# EAGLE design waltron (EAGLE 8.2.2)
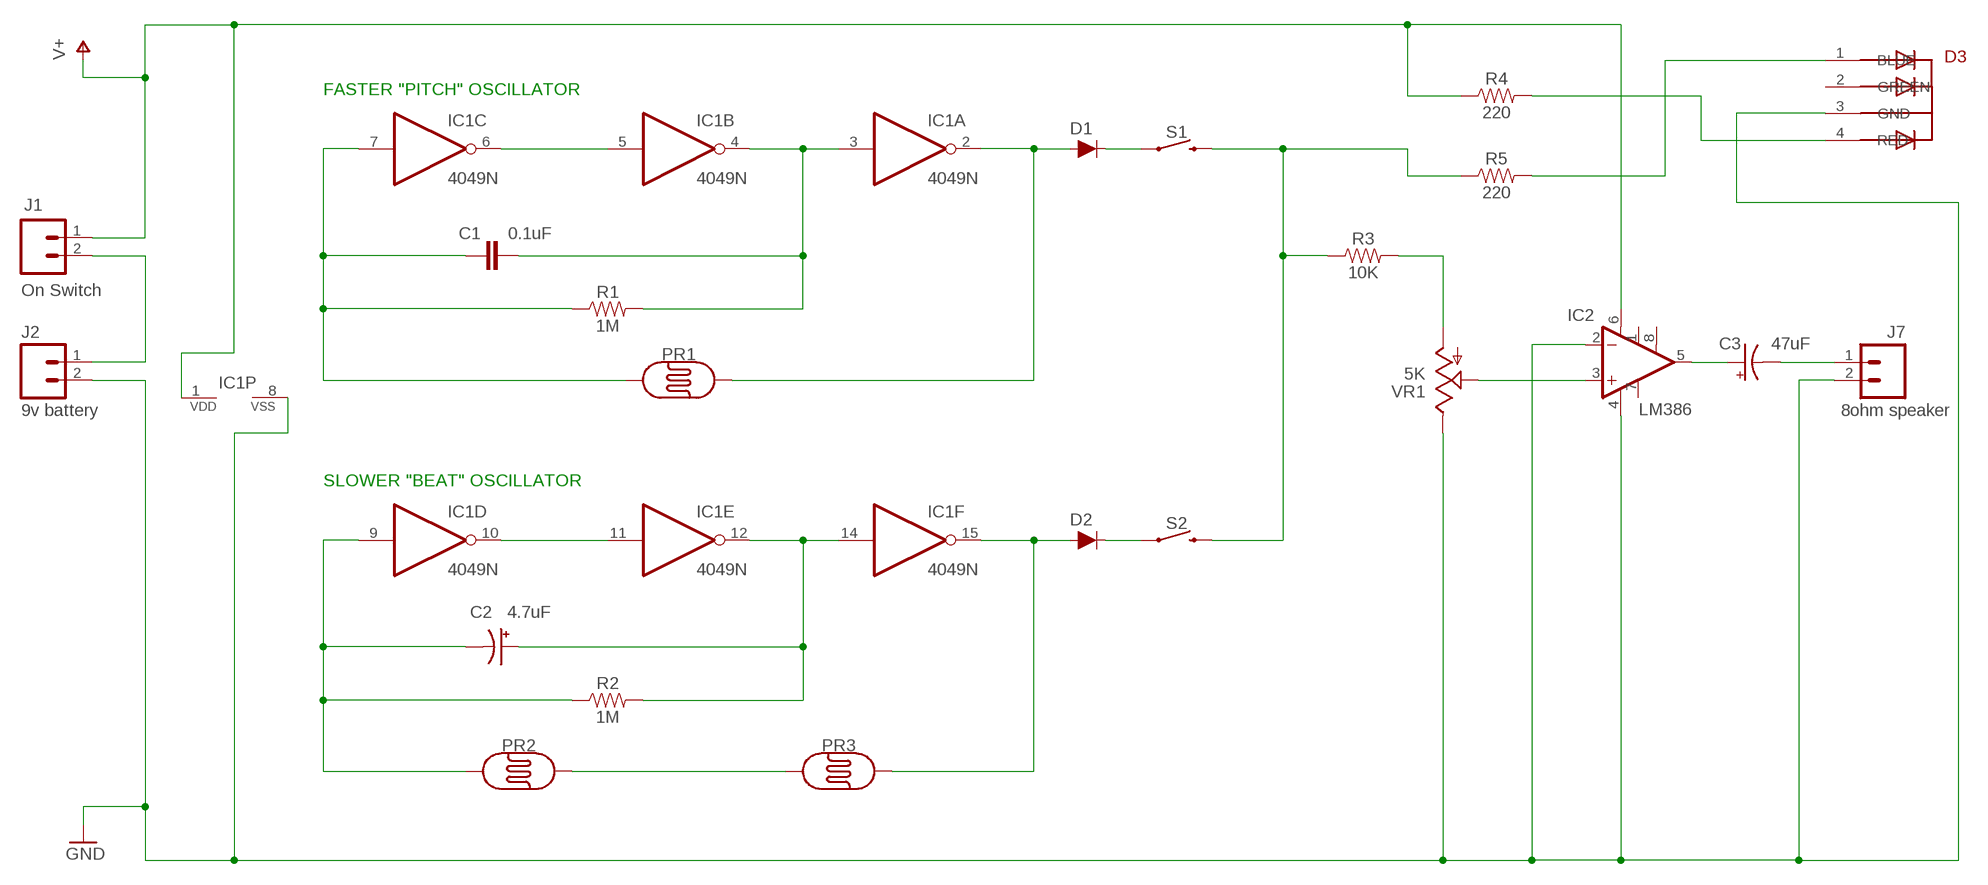
[diagram p0: schematic, sheet 1]

## Parts
C1  0.1uF  0.1UF-KIT-EZ-50V-20%  [CAP-PTH-SMALL-KIT]
C2  4.7uF  10UF-POLAR-RADIAL-2.5MM-25V-20%  [CPOL-RADIAL-2.5MM-5MM]
C3  47uF  10UF-POLAR-RADIAL-2.5MM-25V-20%  [CPOL-RADIAL-2.5MM-5MM]
D1  DIODE-1N4148  [DIODE-1N4148]
D2  DIODE-1N4148  [DIODE-1N4148]
D3  5MMRGBLED  [LED5MMRGB]
IC1  4049N  [DIL16]
IC2  LM386  [DIP08]
J1  On Switch  CONN_02  [1X02]
J2  9v battery  CONN_02  [1X02]
J7  8ohm speaker  CONN_02  [1X02]
PR1  PHOTOCELLPTH-KIT  [PHOTOCELL-KIT]
PR2  PHOTOCELLPTH-KIT  [PHOTOCELL-KIT]
PR3  PHOTOCELLPTH-KIT  [PHOTOCELL-KIT]
R1  1M  1KOHM-HORIZ-1/4W-1%  [AXIAL-0.3]
R2  1M  1KOHM-HORIZ-1/4W-1%  [AXIAL-0.3]
R3  10K  1KOHM-HORIZ-1/4W-1%  [AXIAL-0.3]
R4  220  1KOHM-HORIZ-1/4W-1%  [AXIAL-0.3]
R5  220  1KOHM-HORIZ-1/4W-1%  [AXIAL-0.3]
S1  MOMENTARY-SWITCH-SPST-PTH-6.0MM  [TACTILE_SWITCH_PTH_6.0MM]
S2  MOMENTARY-SWITCH-SPST-PTH-6.0MM  [TACTILE_SWITCH_PTH_6.0MM]
VR1  5K  POTTRIM  [TRIM_POT]

## Nets
GND [supply]: D3.3(GND) IC1.8(P:VSS) IC2.2(-IN) IC2.4(V-) J2.2 J7.2 VR1.2(E)
N$1: IC1.5(B:I) IC1.6(C:O)
N$2: C1.2 IC1.3(A:I) IC1.4(B:O) R1.P$2
N$3: C1.1 IC1.7(C:I) PR1.1 R1.P$1
N$4: D1.A IC1.2(A:O) PR1.2
N$5: C2.2(-) IC1.9(D:I) PR2.1 R2.P$1
N$6: IC1.10(D:O) IC1.11(E:I)
N$7: C2.1(+) IC1.12(E:O) IC1.14(F:I) R2.P$2
N$8: D2.A IC1.15(F:O) PR3.2
N$9: D1.C S1.1
N$10: PR2.2 PR3.1
N$11: D2.C S2.1
N$12: R3.P$1 R5.P$1 S1.3 S2.3
N$13: R3.P$2 VR1.3(A)
N$14: C3.1(+) IC2.5(OUT)
N$15: C3.2(-) J7.1
N$16: IC2.3(+IN) VR1.1(S)
N$17: D3.1(BLUE) R5.P$2
N$18: D3.4(RED) R4.P$2
N$19 [supply]: J1.2 J2.1
V+ [supply]: IC1.1(P:VDD) IC2.6(V+) J1.1 R4.P$1
Unconnected: D3.2(GREEN) IC2.1(GAIN) IC2.7(BP) IC2.8(GAIN)

## Notes on the sheet
- FASTER "PITCH" OSCILLATOR
- SLOWER "BEAT" OSCILLATOR

## Library data of the parts
C1 = SparkFun-Capacitors:0.1UF: 0.1µF ceramic capacitors A capacitor is a passive two-terminal electrical component used to store electrical energy temporarily in an electric field.; PROD_ID: CAP-08370
C2 C3 = SparkFun-Capacitors:10UF-POLAR: 10.0µF polarized capacitors A capacitor is a passive two-terminal electrical component used to store electrical energy temporarily in an electric field.; PROD_ID: CAP-08440; VALUE: 10uF
D1 D2 = SparkFun-DiscreteSemi:DIODE: Diode These are standard reverse protection diodes and small signal diodes. SparkFun Products: SparkFun SparkPunk Sound Kit <https://www.sparkfun.com/products/11177> SparkFun ESP8266 Thing <https://www.sparkfun.com/products/13231>; PROD_ID: DIO-08378; VALUE: 200mA/100V/1V
D3 = tommy:5MMRGBLED: Based on Adafruit's 5MMRGBLED but with polairty indicator mirrored
IC1 = 40xx:4049: Hex inverting BUFFER
IC2 = SparkFun-IC-Amplifiers:LM386: low voltage audio power amplifier SparkFun Products FabFM Radio Kit <https://www.sparkfun.com/products/11043> (KIT-11043); PROD_ID: IC-10899; VALUE: LM386N
J1 J2 J7 = SparkFun-Connectors:CONN_02: Multi connection point. Often used as Generic Header-pin footprint for 0.1 inch spaced/style header connections On any of the 0.1 inch spaced packages, you can populate with these: Break Away Headers - Straight <https://www.sparkfun.com/products/116> (PRT-00116) Break Away Male Headers - Right Angle <https://www.sparkfun.com/products/553> (PRT-00553) Female Headers <https://www.sparkfun.com/products/115> (PRT-00115) Break Away Headers - Machine Pin <https://www.sparkfun.com/products/117> (PRT-00117) Break Away Female Headers - Swiss Machine Pin <https://www.sparkfun.com/products/743> (PRT-00743) For SCREWTERMINALS and SPRING TERMINALS visit here: Screw Terimnals on SparkFun.com <https://www.sparkfun.com/search/results?term=Screw+Terminals> (5mm/3.5mm/2.54mm spacing) This device is also useful as a general connection point to wire up your design to another part of your project. Our various solder wires solder well into these plated through hole pads. Hook-Up Wire - Assortment (Stranded, 22 AWG) <https://www.sparkfun.com/products/11375> (PRT-11375) Hook-Up Wire - Assortment (Solid Core, 22 AWG) <https://www.sparkfun.com/products/11367> (PRT-11367) View the entire wire category on our website here <https://www.sparkfun.com/categories/141> Special notes: Molex polarized connector foot print use with: PRT-08233 with associated crimp pins and housings. 2.54_SCREWTERM for use with PRT-10571. 3.5mm Screw Terminal footprints for PRT-08084 5mm Screw Terminal footprints for use with PRT-08432
PR1-PR3 = SparkFun-Sensors:PHOTOCELL: Photocell (Photodetector, Photo Resistor, CdS) This is a very small light sensor. A photocell changes (also called a photodetector, photo resistor, CdS or photoconductive cell) resistance depending on the amount of light it is exposed to. These little sensors make great ambient light triggers (when light in the room turns on, do something). Datasheet <http://cdn.sparkfun.com/datasheets/Sensors/LightImaging/SEN-09088.pdf> SparkFun Products Mini Photocell <https://www.sparkfun.com/products/9088> (SEN-09088); PROD_ID: COMP-09129; SF_ID: SEN-09088
R1-R5 = SparkFun-Resistors:1KOHM: 1kΩ resistor A resistor is a passive two-terminal electrical component that implements electrical resistance as a circuit element. Resistors act to reduce current flow, and, at the same time, act to lower voltage levels within circuits. - Wikipedia; PROD_ID: RES-12182; VALUE: 1k
S1 S2 = SparkFun-Switches:MOMENTARY-SWITCH-SPST: Momentary Switch (Pushbutton) - SPST Normally-open (NO) SPST momentary switches (buttons, pushbuttons). Variants PTH-12MM - 12mm square, through-hole Momentary Pushbutton Switch - 12mm Square <https://www.sparkfun.com/products/9190> (COM-09190) PTH-6.0MM, PTH-6.0MM-KIT - 6.0mm square, through-hole Mini Pushbutton Switch <https://www.sparkfun.com/products/97> (COM-00097) KIT package intended for soldering kit's - only one side of pads' copper is exposed. PTH-RIGHT-ANGLE-KIT - Right-angle, through-hole Right Angle Tactile Button <https://www.sparkfun.com/products/10791> - Used on SparkFun BigTime Watch Kit <https://www.sparkfun.com/products/11734> SMD-12MM - 12mm square, surface-mount Tactile Button - SMD (12mm) <https://www.sparkfun.com/products/12993> (COM-12993) Used on SparkFun PicoBoard <https://www.sparkfun.com/products/11888> SMD-4.5MM - 4.5mm Square Trackball Switch Used on SparkFun Blackberry Trackballer Breakout <https://www.sparkfun.com/products/13169> SMD-4.6MMX2.8MM - 4.60mm x 2.80mm, surface mount Used on SparkFun SAMD21 Mini Breakout <https://www.sparkfun.com/products/13664> SMD-5.2MM, SMD-5.2-REDUNDANT - 5.2mm square, surface-mount Mini Pushbutton Switch - SMD <https://www.sparkfun.com/products/8720> (COM-08720) Used on Arduino Pro Mini <https://www.sparkfun.com/products/11114> REDUNDANT package connects both switch circuits together SMD-6.0X3.5MM - 6.0 x 3.5mm, surface mount Momentary Reset Switch SMD <https://www.sparkfun.com/products/8229> (COM-08229) SMD-6.2MM-TALL - 6.2mm square, surface mount Tactile Button - SMD (6mm) <https://www.sparkfun.com/products/12992> Used on SparkFun Digital Sandbox <https://www.sparkfun.com/products/12651> SMD-RIGHT-ANGLE - Right-angle, surface mount Used on SparkFun Block for Intel® Edison - Arduino <https://www.sparkfun.com/products/13036>; PROD_ID: SWCH-08441; SF_SKU: COM-00097
VR1 = SparkFun-Retired:POT; PROD_ID: COM-00104

## Net classes
0 default: width 0.254 mm, clearance 0.254 mm
1 supply: width 0.508 mm, clearance 0.508 mm

## Board
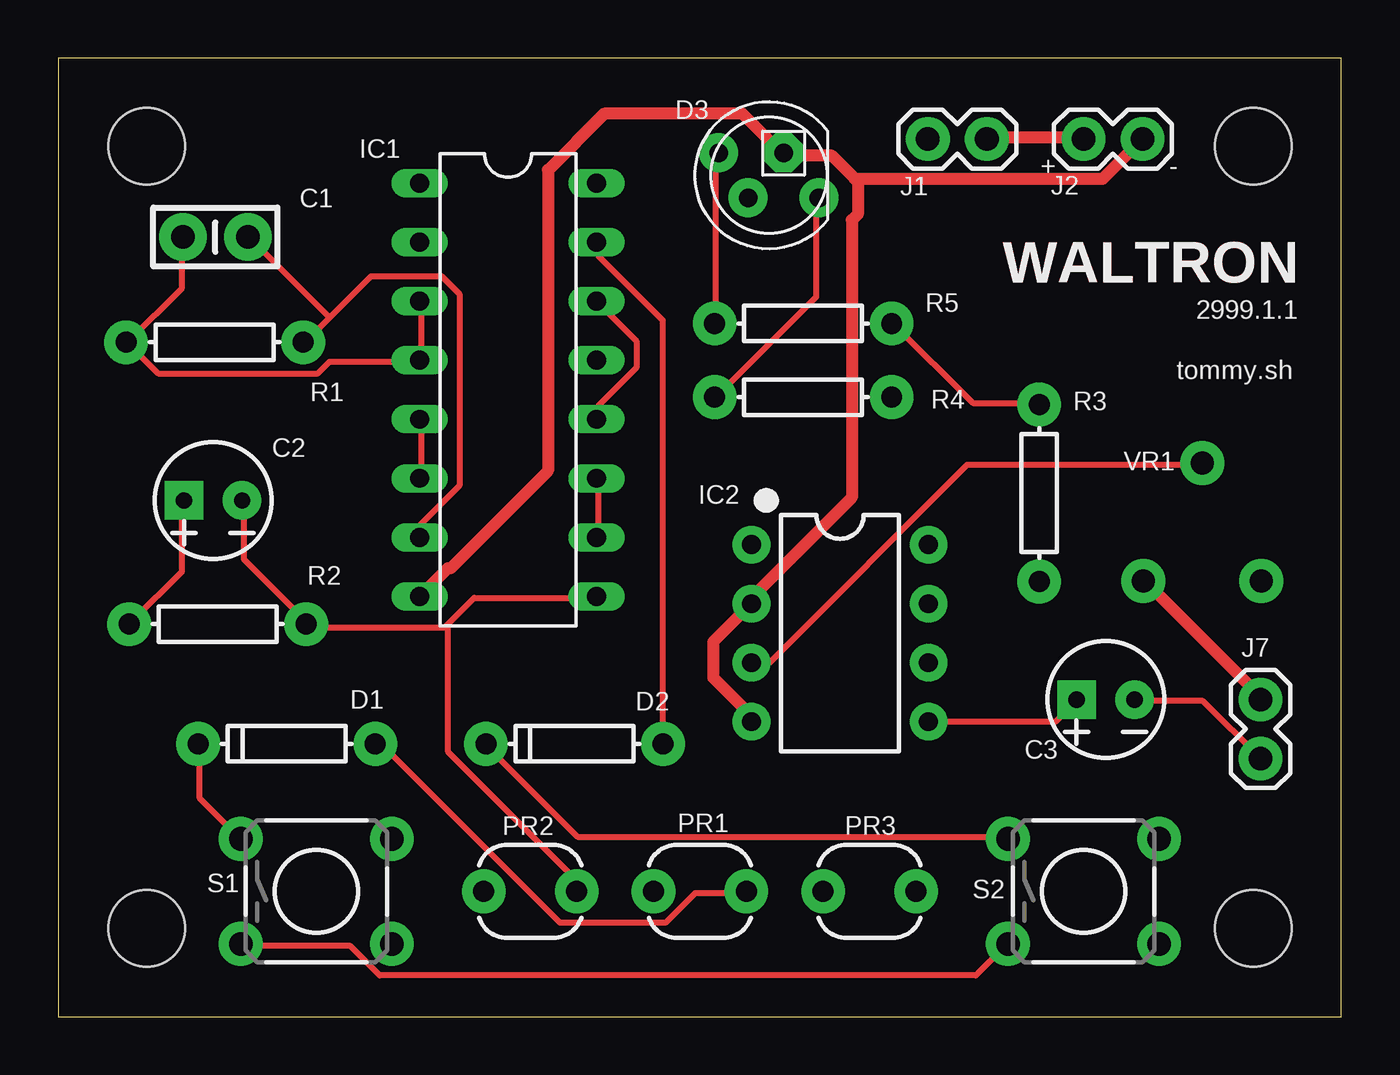
[diagram p1: board, top side]
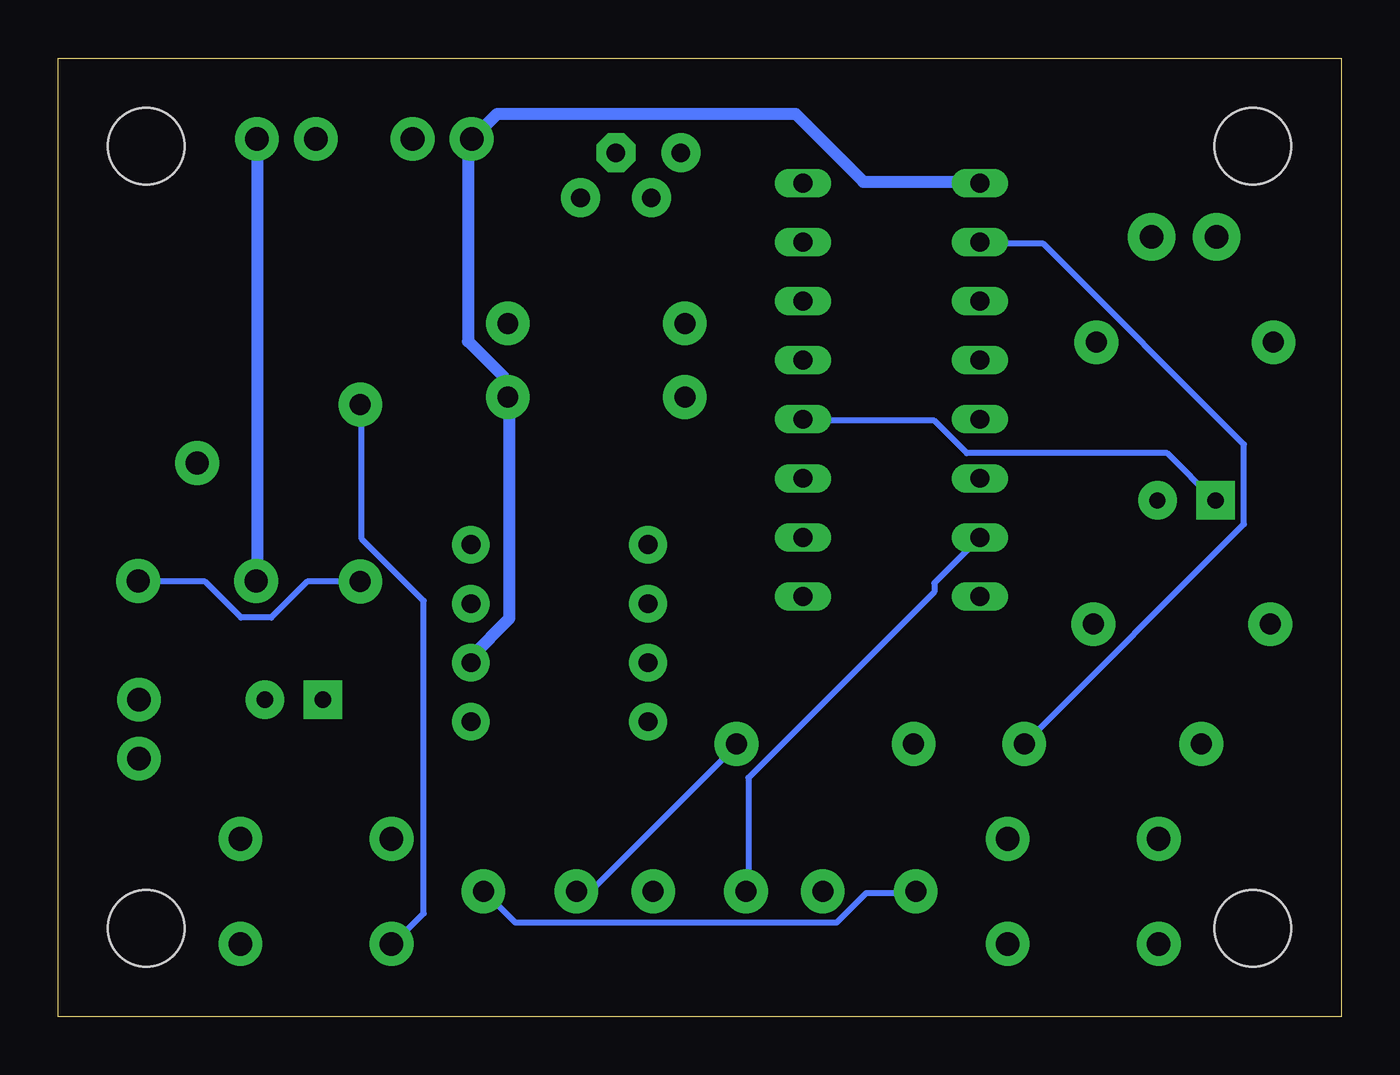
[diagram p2: board, bottom side, seen from below]

Size 55.23 x 41.27 mm. Coordinates in mm from the lower left corner, seen from the top.
Outline: 0,0 55.23,0 55.23,41.27 0,41.27 0,0
Copper layers (1*16): Top 0.0356mm / dielectric 1.5011mm / Bottom 0.0356mm
Design rules "LaenPCBOrder": minimum track width 6mil, minimum drill 13mil, track to track 6mil, track to pad 6mil, pad to pad 6mil, via to via 6mil, smd to smd 6mil, copper to edge 15mil, drill to drill 6mil, minimum pad ring 7mil, minimum via ring 7mil, stop-mask expansion 3mil, vias tented up to drill 0mil, thermal gap 10mil
Holes 3.3 mm at 51.44,3.81 3.81,3.81 3.81,37.47 51.44,37.47

### Footprints (pad centres in the part's own frame; a part is rotated, then mirrored left to right if it is on the bottom)
CAP-PTH-SMALL-KIT = drill 1.016 pad 2.032: 1 -1.397,0; 2 1.397,0
CPOL-RADIAL-2.5MM-5MM = drill 0.7 pad 1.651 square: 1 1.25,0 | drill 0.7 pad 1.651: 2 -1.25,0
DIODE-1N4148 = drill 0.9 pad 1.88: A -3.81,0; C 3.81,0
LED5MMRGB = drill 0.8 pad 1.676: 1 -2.159,-0.968; 2 -0.889,0.968; 4 2.159,0.968 | drill 0.8 pad 1.676 octagon: 3 0.635,-0.968
DIL16 = drill 0.813 long: 1 -8.89,-3.81; 2 -6.35,-3.81; 3 -3.81,-3.81; 4 -1.27,-3.81; 5 1.27,-3.81; 6 3.81,-3.81; 7 6.35,-3.81; 8 8.89,-3.81; 9 8.89,3.81; 10 6.35,3.81; 11 3.81,3.81; 12 1.27,3.81; 13 -1.27,3.81; 14 -3.81,3.81; 15 -6.35,3.81; 16 -8.89,3.81
DIP08 = drill 0.813 pad 1.626: 1 -3.81,-3.81; 2 -1.27,-3.81; 3 1.27,-3.81; 4 3.81,-3.81; 5 3.81,3.81; 6 1.27,3.81; 7 -1.27,3.81; 8 -3.81,3.81
1X02 = drill 1.016 pad 1.88: 1 0,0; 2 2.54,0
PHOTOCELL-KIT = drill 0.9 pad 1.88: 1 -2,0; 2 2,0
AXIAL-0.3 = drill 0.9 pad 1.88: P$1 -3.81,0; P$2 3.81,0
TACTILE_SWITCH_PTH_6.0MM = drill 1.016 pad 1.88: 1 -3.251,2.261; 2 3.251,2.261; 3 -3.251,-2.261; 4 3.251,-2.261
TRIM_POT = drill 1 pad 1.88: 1 5.08,0; 2 0,2.54; 3 0,-2.54

### Placement (x,y rotation side)
C1  6.77,33.57 180 top
C2  6.67,22.23 180 top
C3  45.09,13.65 180 top
D1  9.84,11.75 180 top
D2  22.23,11.75 180 top
D3  30.59,36.22 180 bottom
IC1  19.37,26.99 270 top
IC2  33.66,16.51 270 top
J1  37.43,37.78 0 top
J2  44.13,37.78 0 top
J7  51.75,11.11 90 top
PR1  27.62,5.4 0 top
PR2  20.32,5.4 180 top
PR3  34.92,5.4 180 top
R1  6.74,29.03 180 top
R2  6.87,16.9 180 top
R3  42.23,22.54 270 top
R4  32.07,26.67 180 top
R5  32.07,29.84 180 top
S1  11.11,5.4 0 top
S2  44.13,5.4 0 top
VR1  49.25,18.76 90 top

### Tracks (layer width: path | path; a pad name or v marks a point on that pad's centre or on a via)
GND
  Top 0.508: J7.2 51.82,13.72 46.77,18.76 VR1.2 | IC2.4 29.84,12.95 28.19,14.61 28.19,16.13 IC2.2 29.97,17.91 29.97,18.16 34.16,22.35 34.16,34.29 34.42,34.54 34.42,36.07 | IC1.8 16.76,19.3 16.89,19.3 21.08,23.5 21.08,36.45 23.5,38.86 29.46,38.86 31.11,37.21 D3.3 31.37,37.08 33.27,37.08 34.29,36.07 34.42,36.07 | J2.2 44.96,36.07 34.42,36.07
  Bottom 0.508: J2.2 46.67,18.79 VR1.2
N$1
  Top 0.254: IC1.6 15.62,23.24 15.62,25.65 IC1.5
N$2
  Top 0.254: IC1.3 15.62,30.73 15.62,28.32 IC1.4 15.49,28.19 11.68,28.19 11.18,27.69 4.32,27.69 3.05,28.96 R1.P$2 3.05,29.08 5.33,31.37 5.33,33.53 C1.2
N$3
  Top 0.254: 11.68,30.1 10.67,29.08 R1.P$1 | 11.68,30.1 13.46,31.88 16.51,31.88 17.27,31.11 17.27,22.86 15.62,21.21 15.62,20.7 IC1.7 | 11.68,30.1 8.26,33.53 C1.1
  Bottom 0.254: IC1.7 17.53,18.67 17.53,18.29 25.53,10.29 25.53,5.46 PR1.1
N$4
  Top 0.254: PR1.2 29.59,5.33 27.43,5.33 26.16,4.06 21.59,4.06 13.97,11.68 13.72,11.68 D1.A
  Bottom 0.254: D1.A 4.19,21.21 4.19,24.64 12.83,33.27 15.49,33.27 IC1.2
N$5
  Top 0.254: 16.7,16.83 16.64,16.76 10.92,16.76 10.79,16.89 R2.P$1 10.67,17.02 8,19.68 8,22.23 C2.2 | 16.7,16.83 17.91,18.03 23.11,18.03 IC1.9 | PR2.1 22.23,5.46 22.23,5.97 16.76,11.43 16.76,16.76 16.7,16.83
N$6
  Top 0.254: IC1.10 23.24,20.7 23.24,23.11 IC1.11
N$7
  Top 0.254: IC1.14 24.89,29.08 24.89,27.94 23.24,26.29 23.24,25.78 IC1.12 | C2.1 5.33,22.23 5.33,19.18 3.17,17.02 R2.P$2
  Bottom 0.254: IC1.12 23.11,25.65 17.53,25.65 16.13,24.26 7.49,24.26 5.46,22.23 C2.1
N$8
  Top 0.254: D2.A 26.04,29.97 23.24,32.77 23.24,33.27 IC1.15
  Bottom 0.254: PR3.2 32.89,5.46 32.26,5.46 26.04,11.68 D2.A
N$9
  Top 0.254: D1.C 6.1,11.68 6.1,9.4 7.75,7.75 S1.1
N$10
  Bottom 0.254: PR2.2 18.41,5.33 20.45,5.33 21.72,4.06 35.56,4.06 36.83,5.33 PR3.1
N$11
  Top 0.254: S2.1 40.77,7.75 22.35,7.75 18.41,11.68 D2.C
N$12
  Top 0.254: R3.P$1 42.16,26.42 39.37,26.42 35.94,29.84 R5.P$1 | S1.3 7.87,3.05 12.57,3.05 13.84,1.78 39.5,1.78 40.77,3.05 S2.3
  Bottom 0.254: R3.P$1 42.16,26.29 42.16,20.57 39.5,17.91 39.5,4.45 40.77,3.17 S2.3
N$13
  Bottom 0.254: R3.P$2 44.51,18.73 46.05,17.18 47.36,17.18 48.91,18.73 51.76,18.73 VR1.3
N$14
  Top 0.254: IC2.5 42.93,12.7 43.81,13.59 C3.1
N$15
  Top 0.254: J7.1 49.28,13.59 46.35,13.59 C3.2
N$16
  Top 0.254: IC2.3 30.61,15.24 39.12,23.75 49.15,23.75 VR1.1
N$17
  Top 0.254: D3.1 28.32,37.08 28.32,29.84 R5.P$2
N$18
  Top 0.254: D3.4 32.64,35.18 32.64,30.99 28.32,26.67 R4.P$2
N$19
  Top 0.508: J1.2 40.01,37.85 44.07,37.85 J2.1
V+
  Bottom 0.508: IC2.6 37.47,15.49 35.81,17.14 35.81,26.67 R4.P$1 36.07,26.8 36.07,27.56 37.59,29.08 37.59,37.59 J1.1 37.34,37.85 36.32,38.86 23.5,38.86 20.57,35.94 15.62,35.94 IC1.1

### Text on the board
Top: WALTRON
tPlace: + | - | C1 | WALTRON | 2999.1.1 | tommy.sh